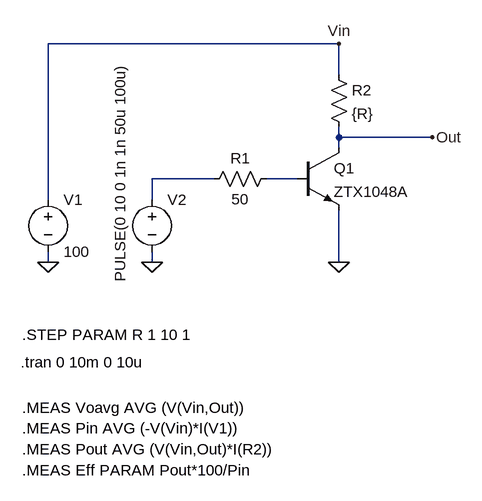
[diagram p0: schematic Task1C_BJT_ChopperCircuit.asc]
Task1C_BJT_ChopperCircuit.asc, the LTspice schematic file:
Version 4
SHEET 1 880 680
WIRE 544 -80 96 -80
WIRE 544 -32 544 -80
WIRE 544 64 544 48
WIRE 688 64 544 64
WIRE 544 80 544 64
WIRE 352 128 256 128
WIRE 480 128 432 128
WIRE 96 160 96 -80
WIRE 256 160 256 128
WIRE 96 256 96 240
WIRE 256 256 256 240
WIRE 544 256 544 176
FLAG 96 256 0
FLAG 256 256 0
FLAG 544 256 0
FLAG 688 64 Out
FLAG 544 -80 Vin
SYMBOL voltage 96 144 R0
WINDOW 123 0 0 Left 0
WINDOW 39 0 0 Left 0
SYMATTR InstName V1
SYMATTR Value 100
SYMBOL voltage 256 144 R0
WINDOW 3 -49 -195 VRight 2
WINDOW 123 0 0 Left 0
WINDOW 39 0 0 Left 0
SYMATTR InstName V2
SYMATTR Value PULSE(0 10 0 1n 1n 50u 100u)
SYMBOL res 448 112 R90
WINDOW 0 0 56 VBottom 2
WINDOW 3 32 56 VTop 2
SYMATTR InstName R1
SYMATTR Value 50
SYMBOL npn 480 80 R0
SYMATTR InstName Q1
SYMATTR Value ZTX1048A
SYMBOL res 528 -48 R0
SYMATTR InstName R2
SYMATTR Value {R}
TEXT 54 410 Left 2 !.tran 0 10m 0 10u
TEXT 56 480 Left 2 !.MEAS Voavg AVG (V(Vin,Out))
TEXT 56 512 Left 2 !.MEAS Pin AVG (-V(Vin)*I(V1))
TEXT 56 544 Left 2 !.MEAS Pout AVG (V(Vin,Out)*I(R2))
TEXT 56 576 Left 2 !.MEAS Eff PARAM Pout*100/Pin
TEXT 56 368 Left 2 !.STEP PARAM R 1 10 1

The netlist it stands for:
* Task1C_BJT_ChopperCircuit.asc
V1 Vin 0 100
V2 N001 0 PULSE(0 10 0 1n 1n 50u 100u)
R1 N002 N001 50
Q1 Out N002 0 0 ZTX1048A
R2 Vin Out {R}
.model NPN NPN
.model PNP PNP
.lib standard.bjt
.tran 0 10m 0 10u
.MEAS Voavg AVG (V(Vin,Out))
.MEAS Pin AVG (-V(Vin)*I(V1))
.MEAS Pout AVG (V(Vin,Out)*I(R2))
.MEAS Eff PARAM Pout*100/Pin
.STEP PARAM R 1 10 1
.backanno
.end